# Altium project Temp Fan Speed Ctrl.PrjPCB
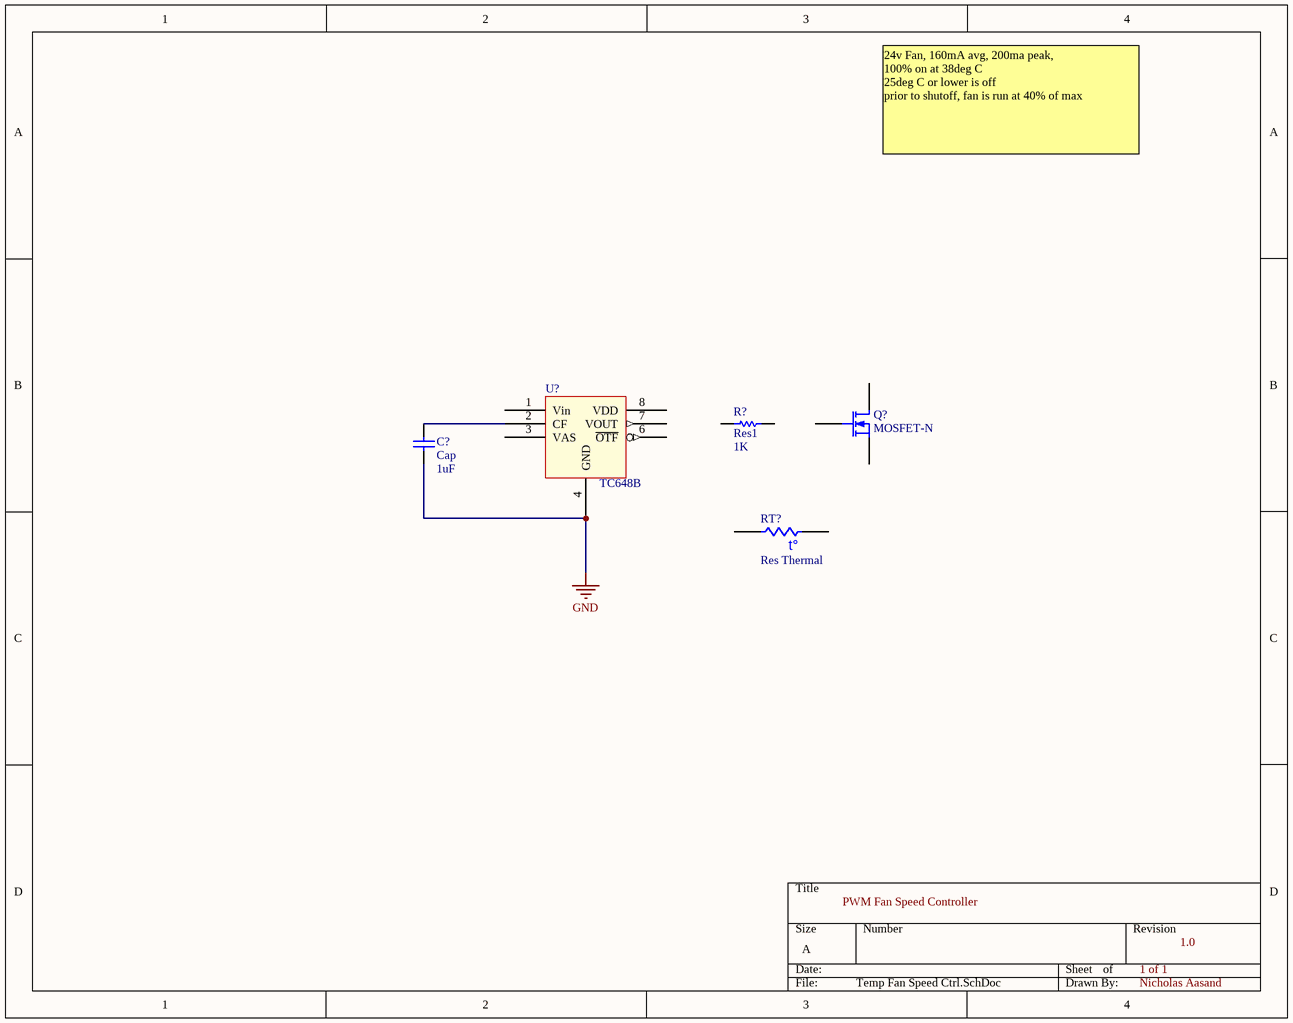
[diagram p0: Temp Fan Speed Ctrl.SchDoc]
1 sheet, 5 parts. Net scope: global (net labels, ports and power ports of the same name join across sheets).

## Sheet Temp Fan Speed Ctrl.SchDoc
size A

### Parts
C?  Cap  value 1uF  [RAD-0.3]
Q?  MOSFET-N  [E3]
R?  Res1  value 1K  [AXIAL-0.3]
RT?  Res Thermal  [6-0805_N]
U?  TC648B

### Nets
GND: C?.1 U?.4(GND)
NetC?_2: C?.2 U?.2(CF)

Not connected (* = marked no-connect by the designer): Q? 1(D) 2(G) 3(S); R? 1 2; RT? 1 2; U? 1(Vin) 3(VAS) 5(NC) 6(~{OTF}) 7(VOUT) 8(VDD)

### Notes on the sheet
- 24v Fan, 160mA avg, 200ma peak,
  100% on at 38deg C
  25deg C or lower is off
  prior to shutoff, fan is run at 40% of max
- PWM Fan Speed Controller
- 1 of 1
- 1.0
- Nicholas Aasand
- (in symbol Res Thermal) t°

### Library data of the parts
C? = Cap: Capacitor; Published: 8-Jun-2000; LatestRevisionDate: 17-Jul-2002; LatestRevisionNote: Re-released for DXP Platform.; PackageReference: RAD-0.3; Publisher: Altium Limited; PackageDescription: Radial Cap, Thru-Hole; 2 Leads; 0.3 in Pin Spacing
Q? = MOSFET-N: N-Channel MOSFET; Published: 8-Jun-2000; LatestRevisionDate: 17-Jul-2002; LatestRevisionNote: Re-released for DXP Platform.; PackageVersion: 1995/1996; PackageReference: E3; Publisher: Altium Limited; PackageDescription: TO, Flat Index; 3 In-Line, Axial Leads; Body Dia. 4.6mm; Lead Dia. 0.5 mm (max); Digikey: DMN10H220L-7DICT-ND
R? = Res1: Resistor; Published: 8-Jun-2000; LatestRevisionDate: 17-Jul-2002; LatestRevisionNote: Re-released for DXP Platform.; PackageReference: AXIAL-0.3; Publisher: Altium Limited; PackageDescription: Axial Device, Thru-Hole; 2 Leads; 0.3 in Pin Spacing
RT? = Res Thermal: Thermistor; Published: 24-Mar-1999; LatestRevisionDate: 29-May-2009; LatestRevisionNote: IPC-7351 Footprint Added.; PackageVersion: Mar-2003; PackageReference: 6-0805; Publisher: Altium Limited; PackageDescription: Chip Resistor 0805 Case Size; Code_IPC: RESC2012; Digikey: NXRT15WF104FA1B040
U? = TC648B: PWM Fan Speed Controllers With Auto-Shutdown